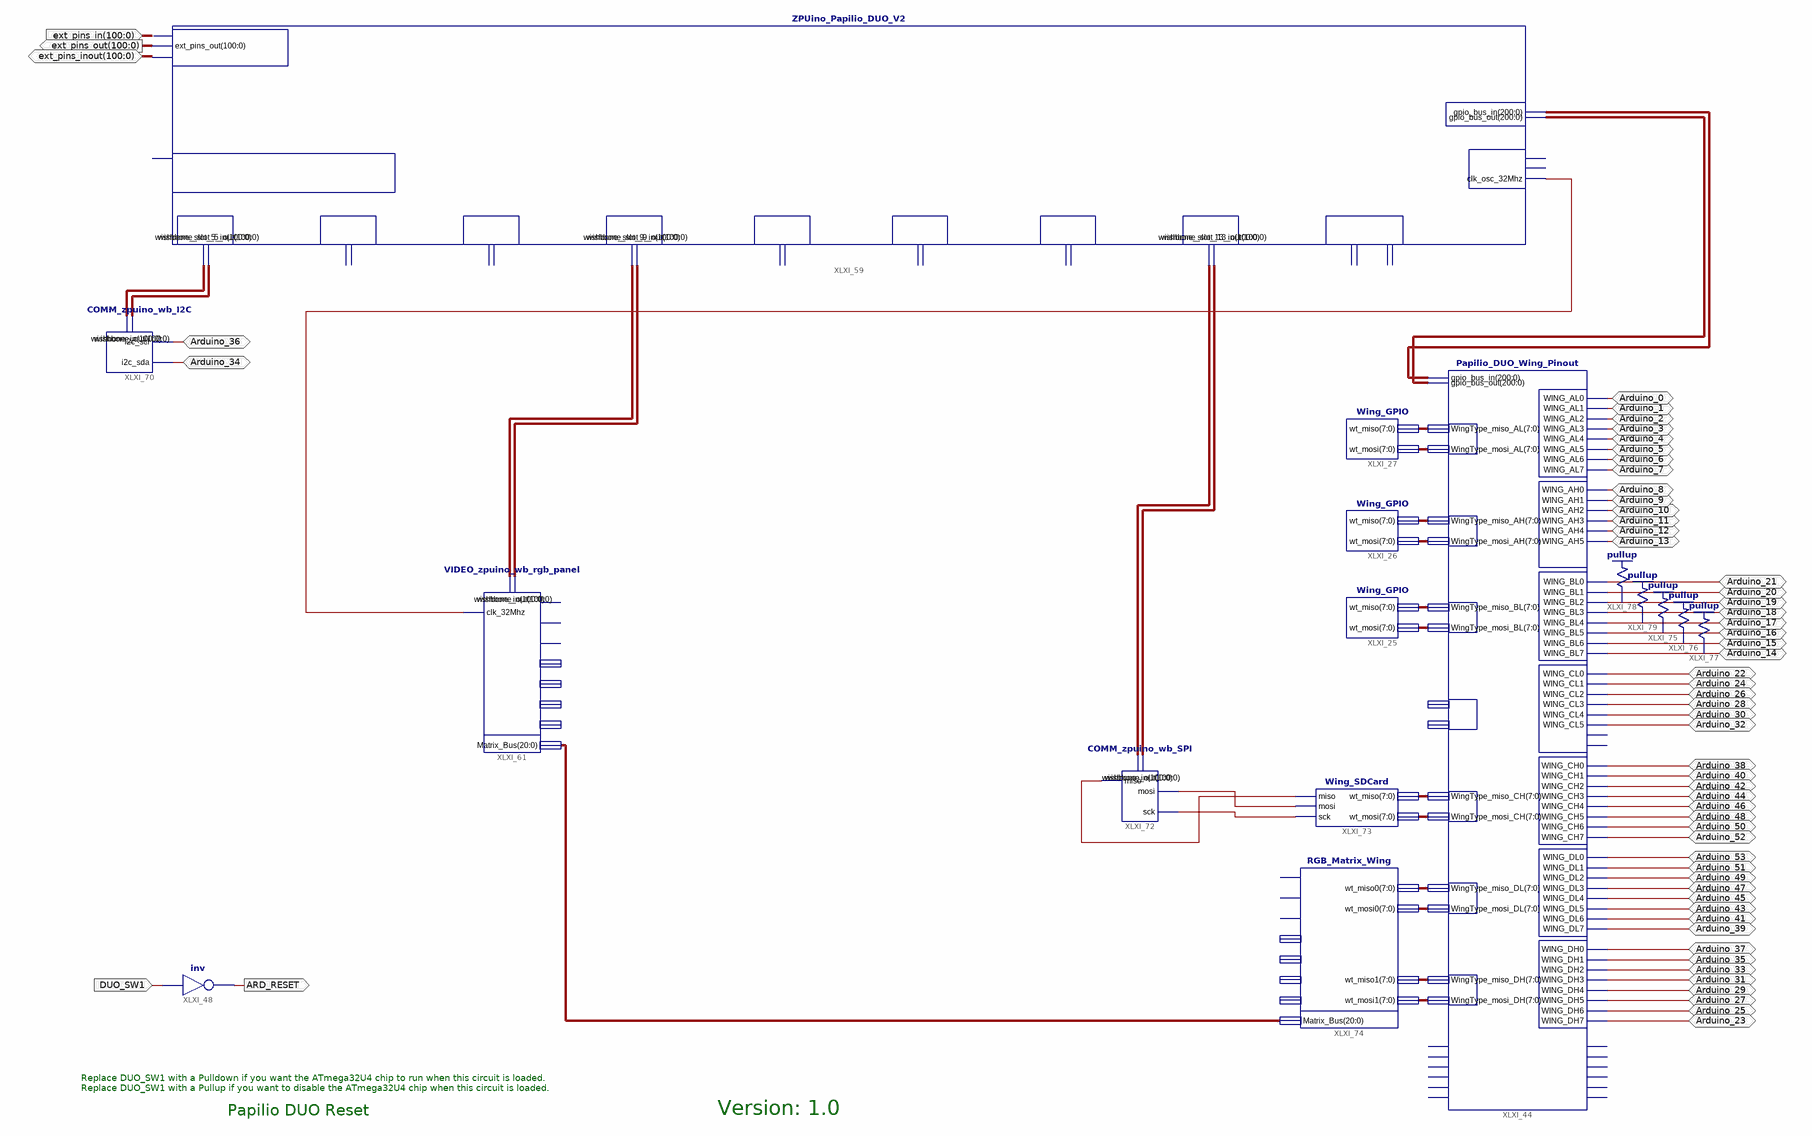
[diagram p0: schematic sheet 1]
// Xilinx ISE schematic Papilio_DUO_LX9.sch (spartan6) as structural Verilog: 16 symbols, 59 ports
module Papilio_DUO_LX9 (
  input  [100:0] ext_pins_in,
  input  DUO_SW1,
  inout  [100:0] ext_pins_inout,
  inout  Arduino_34,
  inout  Arduino_36,
  inout  Arduino_22,
  inout  Arduino_24,
  inout  Arduino_26,
  inout  Arduino_28,
  inout  Arduino_30,
  inout  Arduino_32,
  inout  Arduino_38,
  inout  Arduino_40,
  inout  Arduino_42,
  inout  Arduino_44,
  inout  Arduino_46,
  inout  Arduino_48,
  inout  Arduino_50,
  inout  Arduino_52,
  inout  Arduino_53,
  inout  Arduino_51,
  inout  Arduino_49,
  inout  Arduino_47,
  inout  Arduino_45,
  inout  Arduino_43,
  inout  Arduino_41,
  inout  Arduino_39,
  inout  Arduino_37,
  inout  Arduino_35,
  inout  Arduino_33,
  inout  Arduino_31,
  inout  Arduino_29,
  inout  Arduino_27,
  inout  Arduino_25,
  inout  Arduino_23,
  inout  Arduino_0,
  inout  Arduino_1,
  inout  Arduino_2,
  inout  Arduino_3,
  inout  Arduino_4,
  inout  Arduino_5,
  inout  Arduino_6,
  inout  Arduino_7,
  inout  Arduino_8,
  inout  Arduino_9,
  inout  Arduino_10,
  inout  Arduino_11,
  inout  Arduino_12,
  inout  Arduino_13,
  inout  Arduino_21,
  inout  Arduino_20,
  inout  Arduino_18,
  inout  Arduino_14,
  inout  Arduino_15,
  inout  Arduino_17,
  inout  Arduino_19,
  inout  Arduino_16,
  output [100:0] ext_pins_out,
  output ARD_RESET
);

  wire XLXN_621, XLXN_635, XLXN_636, XLXN_637;
  wire [7:0] XLXN_331, XLXN_332, XLXN_333, XLXN_334, XLXN_335, XLXN_336, XLXN_632, XLXN_633, XLXN_638,
       XLXN_639, XLXN_640, XLXN_641;
  wire [20:0] XLXN_642;
  wire [100:0] XLXN_622, XLXN_623, XLXN_626, XLXN_627, XLXN_630, XLXN_631;
  wire [200:0] XLXN_598, XLXN_599;

  ZPUino_Papilio_DUO_V2 XLXI_59 (
    .gpio_bus_out(XLXN_599), .gpio_bus_in(XLXN_598), .clk_osc_32Mhz(XLXN_621), .ext_pins_in(ext_pins_in),
    .ext_pins_out(ext_pins_out), .ext_pins_inout(ext_pins_inout), .wishbone_slot_5_out(XLXN_627),
    .wishbone_slot_5_in(XLXN_626), .wishbone_slot_9_in(XLXN_622), .wishbone_slot_9_out(XLXN_623),
    .wishbone_slot_13_in(XLXN_630), .wishbone_slot_13_out(XLXN_631));  // open: clk_96Mhz, clk_1Mhz, AVR_Wishbone_Bridge_Enable, wishbone_slot_6_in, wishbone_slot_6_out, wishbone_slot_8_in, wishbone_slot_8_out, wishbone_slot_10_in, wishbone_slot_10_out, wishbone_slot_11_in, wishbone_slot_11_out, wishbone_slot_12_in, wishbone_slot_12_out, wishbone_slot_14_in, wishbone_slot_14_out, wishbone_slot_video_in, wishbone_slot_video_out
  not XLXI_48 (ARD_RESET, DUO_SW1);
  VIDEO_zpuino_wb_rgb_panel XLXI_61 (
    .wishbone_out(XLXN_623), .wishbone_in(XLXN_622), .clk_32Mhz(XLXN_621), .Matrix_Bus(XLXN_642));  // open: R, G, B, COL, CLK, STB, OE
  COMM_zpuino_wb_I2C XLXI_70 (
    .i2c_scl(Arduino_36), .i2c_sda(Arduino_34), .wishbone_in(XLXN_626), .wishbone_out(XLXN_627));
  COMM_zpuino_wb_SPI XLXI_72 (
    .miso(XLXN_637), .sck(XLXN_635), .mosi(XLXN_636), .wishbone_in(XLXN_630), .wishbone_out(XLXN_631));
  RGB_Matrix_Wing XLXI_74 (
    .wt_miso0(XLXN_638), .wt_mosi0(XLXN_639), .wt_miso1(XLXN_640), .wt_mosi1(XLXN_641), .Matrix_Bus(XLXN_642));  // open: CLK, STB, OE, R, G, B, COL
  Wing_SDCard XLXI_73 (.wt_miso(XLXN_632), .wt_mosi(XLXN_633), .sck(XLXN_635), .mosi(XLXN_636), .miso(XLXN_637));
  Wing_GPIO XLXI_25 (.wt_miso(XLXN_331), .wt_mosi(XLXN_332));
  Wing_GPIO XLXI_26 (.wt_miso(XLXN_333), .wt_mosi(XLXN_334));
  Wing_GPIO XLXI_27 (.wt_miso(XLXN_335), .wt_mosi(XLXN_336));
  Papilio_DUO_Wing_Pinout XLXI_44 (
    .WING_AH0(Arduino_8), .WING_AH1(Arduino_9), .WING_AH2(Arduino_10), .WING_AH3(Arduino_11),
    .WING_AH4(Arduino_12), .WING_AH5(Arduino_13), .WING_AL0(Arduino_0), .WING_AL1(Arduino_1),
    .WING_AL2(Arduino_2), .WING_AL3(Arduino_3), .WING_AL4(Arduino_4), .WING_AL5(Arduino_5),
    .WING_BL0(Arduino_21), .WING_BL1(Arduino_20), .WING_BL2(Arduino_19), .WING_BL3(Arduino_18),
    .WING_BL4(Arduino_17), .WING_BL5(Arduino_16), .WING_BL6(Arduino_15), .WING_BL7(Arduino_14),
    .gpio_bus_out(XLXN_599), .gpio_bus_in(XLXN_598), .WingType_miso_BL(XLXN_331),
    .WingType_miso_AH(XLXN_333), .WingType_mosi_BL(XLXN_332), .WingType_mosi_AH(XLXN_334),
    .WingType_mosi_AL(XLXN_336), .WingType_miso_AL(XLXN_335), .WING_CL0(Arduino_22), .WING_CL1(Arduino_24),
    .WING_CL2(Arduino_26), .WING_CL3(Arduino_28), .WING_CL4(Arduino_30), .WING_CL5(Arduino_32),
    .WING_CH0(Arduino_38), .WING_CH1(Arduino_40), .WING_CH2(Arduino_42), .WING_CH3(Arduino_44),
    .WING_CH4(Arduino_46), .WING_CH5(Arduino_48), .WING_CH6(Arduino_50), .WING_CH7(Arduino_52),
    .WingType_miso_CH(XLXN_632), .WingType_mosi_CH(XLXN_633), .WING_DL0(Arduino_53), .WING_DL1(Arduino_51),
    .WING_DL2(Arduino_49), .WING_DL3(Arduino_47), .WING_DL4(Arduino_45), .WING_DL5(Arduino_43),
    .WING_DL6(Arduino_41), .WING_DL7(Arduino_39), .WING_DH0(Arduino_37), .WING_DH1(Arduino_35),
    .WING_DH2(Arduino_33), .WING_DH3(Arduino_31), .WING_DH4(Arduino_29), .WING_DH5(Arduino_27),
    .WING_DH6(Arduino_25), .WING_DH7(Arduino_23), .WingType_mosi_DL(XLXN_639), .WingType_mosi_DH(XLXN_641),
    .WingType_miso_DH(XLXN_640), .WingType_miso_DL(XLXN_638), .WING_AL7(Arduino_7), .WING_AL6(Arduino_6));  // open: WING_CL6, WING_CL7, WingType_mosi_CL, WingType_miso_CL, Flex_Pin_out_0, Flex_Pin_out_1, Flex_Pin_out_2, Flex_Pin_out_3, Flex_Pin_out_4, Flex_Pin_out_5, Flex_Pin_in_0, Flex_Pin_in_1, Flex_Pin_in_2, Flex_Pin_in_3, Flex_Pin_in_4, Flex_Pin_in_5
  \pullup  XLXI_78 (.O(Arduino_19));
  \pullup  XLXI_79 (.O(Arduino_17));
  \pullup  XLXI_77 (.O(Arduino_14));
  \pullup  XLXI_76 (.O(Arduino_15));
  \pullup  XLXI_75 (.O(Arduino_16));

  // Notes on the sheet:
  //   Replace DUO_SW1 with a Pulldown if you want the ATmega32U4 chip to run when this circuit is loaded.
  //   Replace DUO_SW1 with a Pullup if you want to disable the ATmega32U4 chip when this circuit is loaded.
  //   Version: 1.0
  //   Papilio DUO Reset
endmodule
